# EAGLE design driver-board (EAGLE 9.3.0)

## Sheet 1 of 2
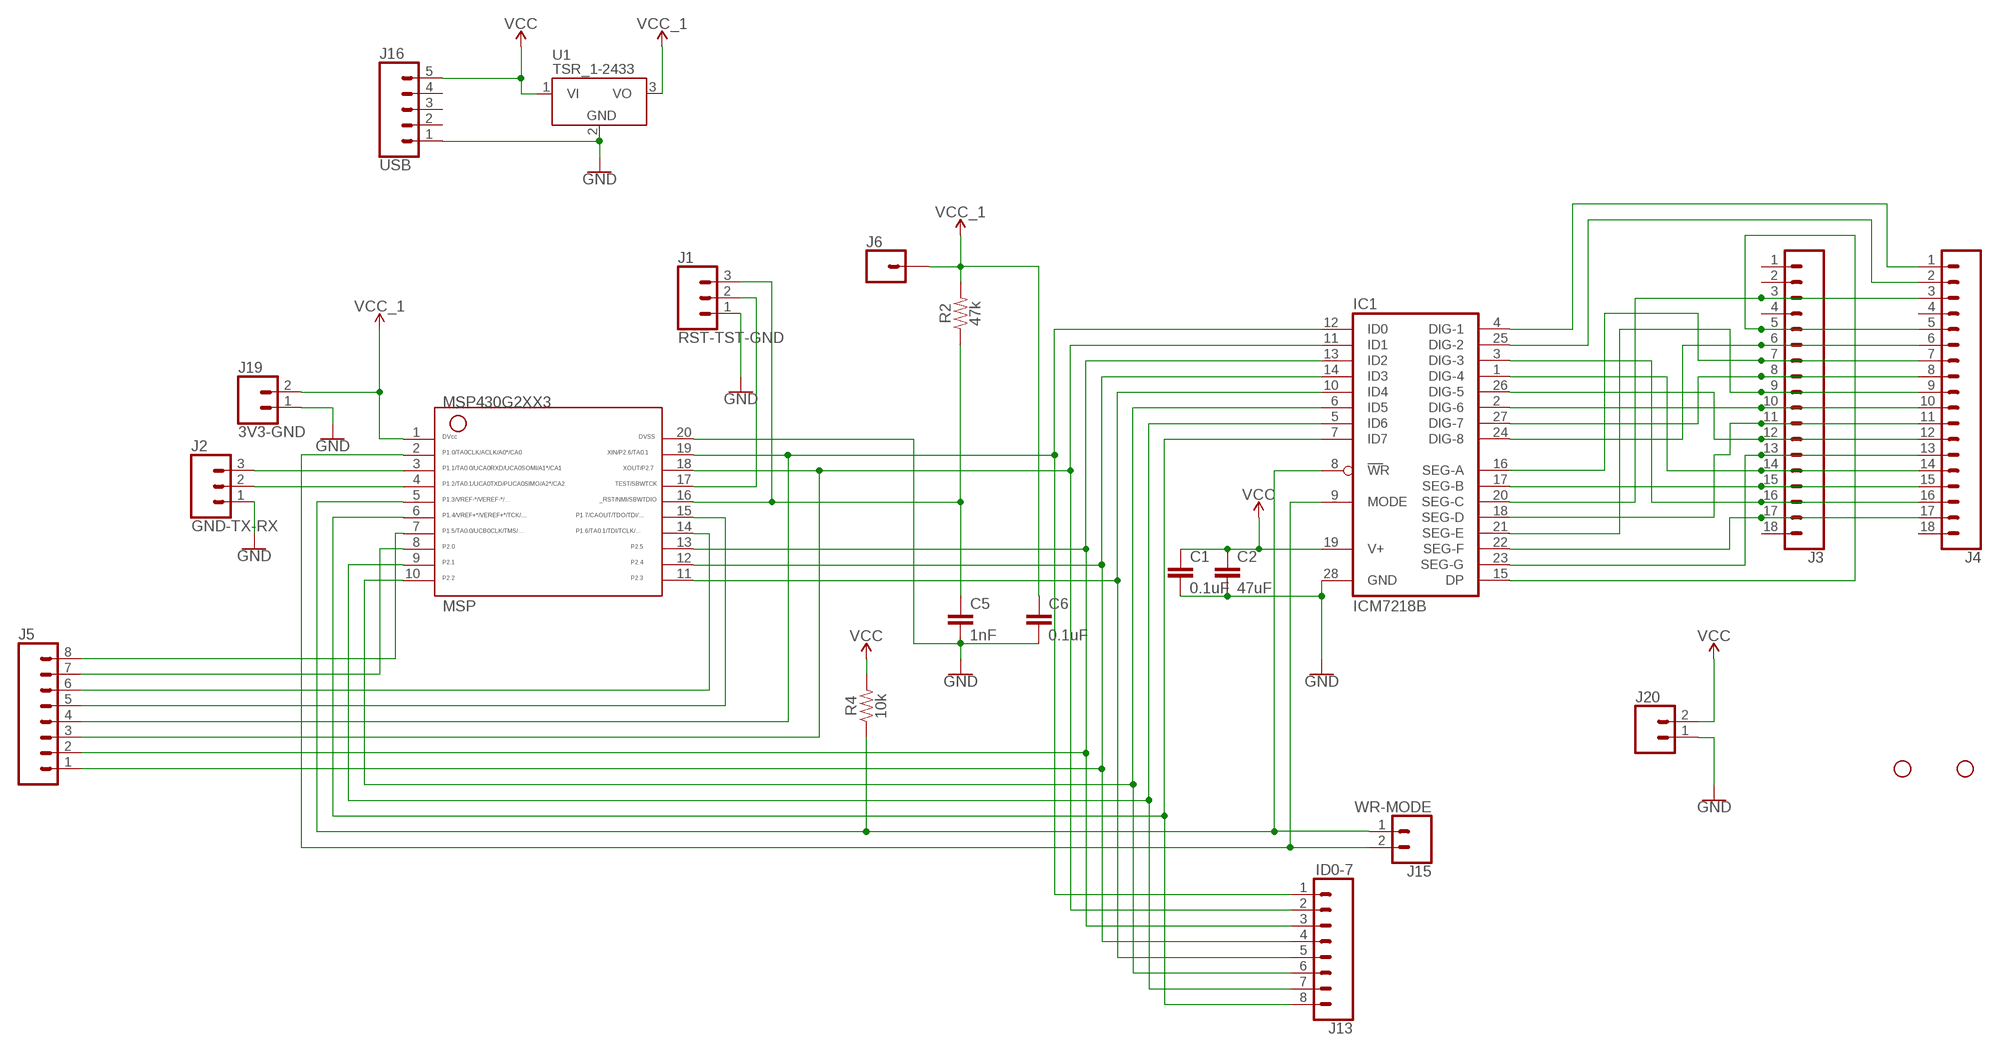
[diagram p0: schematic, sheet 1]

### Parts
C1  0.1uF  C2.5/2  [C2.5-2]
C2  47uF  C2.5/5  [C2.5-5]
C5  1nF  C5/2.5  [C5B2.5]
C6  0.1uF  C5/2.5  [C5B2.5]
H1  STAND-OFF  [STAND-OFF]
H2  STAND-OFF  [STAND-OFF]
IC1  ICM7218B  [DIL28-6]
J1  RST-TST-GND  CONN_03LOCK  [1X03_LOCK]
J2  GND-TX-RX  CONN_03LOCK  [1X03_LOCK]
J3  CONN_18  [1X18]
J4  CONN_18  [1X18]
J5  CONN_08"  [1X08]
J6  CONN_01  [1X01]
J13  ID0-7  CONN_08LOCK  [1X08_LOCK]
J15  WR-MODE  CONN_02  [1X02]
J16  USB  CONN_05LOCK  [1X05_LOCK]
J19  3V3-GND  CONN_02  [1X02]
J20  CONN_02  [1X02]
MSP  G2XX3---N20  [N20]
R2  47k  1KOHM-HORIZ-1/4W-1%  [AXIAL-0.3]
R4  10k  10KOHM-HORIZ-1/4W-1%  [AXIAL-0.3]
U1  TSR_1-2433  [TSR-1]

### Nets
GND: C1.2 C2.2 C5.2 C6.2 IC1.28(GND) J1.1 J2.1 J16.1 J19.1 J20.1 MSP.20 U1.2(GND)
N$1: IC1.3(DIG-3) J3.16 J4.16
N$2: IC1.1(DIG-4) J3.14 J4.14
N$3: IC1.26(DIG-5) J3.12 J4.12
N$4: J5.8 MSP.7
N$5: IC1.2(DIG-6) J3.10 J4.10
N$6: IC1.27(DIG-7) J3.8 J4.8
N$7: IC1.15(DP) J3.5 J4.5
N$8: IC1.23(SEG-G) J3.13 J4.13
N$9: IC1.24(DIG-8) J3.6 J4.6
N$10: IC1.22(SEG-F) J3.17 J4.17
N$11: IC1.20(SEG-C) J3.3 J4.3
N$12: J5.7 MSP.8
N$13: IC1.17(SEG-B) J3.15 J4.15
N$14: IC1.18(SEG-D) J3.11 J4.11
N$15: IC1.21(SEG-E) J3.9 J4.9
N$16: IC1.16(SEG-A) J3.7 J4.7
N$17: IC1.25(DIG-2) J4.2
N$18: IC1.4(DIG-1) J4.1
N$19: J2.2 MSP.4
N$20: J5.6 MSP.14
N$21: C5.1 J1.3 MSP.16 R2.P$1
N$22: J5.5 MSP.15
N$26: J1.2 MSP.17
N$27: IC1.14(ID3) J5.1 J13.4 MSP.12
N$28: IC1.10(ID4) J13.5 MSP.11
N$29: IC1.12(ID0) J5.4 J13.1 MSP.19
N$30: IC1.11(ID1) J5.3 J13.2 MSP.18
N$31: IC1.6(ID5) J13.6 MSP.10
N$32: IC1.5(ID6) J13.7 MSP.9
N$33: IC1.7(ID7) J13.8 MSP.6
N$34: IC1.8(WR) J15.1 MSP.5 R4.P$1
N$35: IC1.9(MODE) J15.2 MSP.2
N$36: J2.3 MSP.3
N$40: IC1.13(ID2) J5.2 J13.3 MSP.13
VCC: C1.1 C2.1 IC1.19(V+) J16.5 J20.2 R4.P$2 U1.1(VI)
VCC_1: C6.1 J6.1 J19.2 MSP.1 R2.P$2 U1.3(VO)
Unconnected: J3.1 J3.2 J3.4 J3.18 J4.4 J4.18 J16.2 J16.3 J16.4

## Sheet 2 of 2

## Library data of the parts
C1 C2 C5 C6 = capacitor-wima:C: CAPACITOR naming: grid - package width
H1 H2 = SparkFun-Hardware:STAND-OFF: Stand Off Drill holes for mechanically mounting via screws, standoffs, etc. Note: Use the keepout ring to avoid running the screw head into surrounding components. Variant Overviews STAND-OFF - Mechanical footprint for a #4 phillips button head screw. STAND-OFF-TIGHT - Mechanical footprint for a #4 phillips button head screw, Example SparkFun Products Screw - Phillips Head (1/4", 4-40, 10 pack) <https://www.sparkfun.com/products/10453> (PRT-10453) Screw - Phillips Head (1/2", 4-40, 10 pack) <https://www.sparkfun.com/products/10452> (PRT-10452) Screw - Phillips Head (3/4", 4-40, 10 pack) <https://www.sparkfun.com/products/10451> (PRT-10451) Screw - Phillips Head (1", 4-40, 10 pack) <https://www.sparkfun.com/products/10450> (PRT-10450)
IC1 = maxim:ICM7218B: LED DECODER DRIVER; MF: INTERSIL; MPN: ICM7218BIJI; OC_FARNELL: 406004; OC_NEWARK: 06F7545
J1 J2 = SparkFun-Connectors:CONN_03: Multi connection point. Often used as Generic Header-pin footprint for 0.1 inch spaced/style header connections On any of the 0.1 inch spaced packages, you can populate with these: Break Away Headers - Straight <https://www.sparkfun.com/products/116> (PRT-00116) Break Away Male Headers - Right Angle <https://www.sparkfun.com/products/553> (PRT-00553) Female Headers <https://www.sparkfun.com/products/115> (PRT-00115) Break Away Headers - Machine Pin <https://www.sparkfun.com/products/117> (PRT-00117) Break Away Female Headers - Swiss Machine Pin <https://www.sparkfun.com/products/743> (PRT-00743) Stackable Header - 3 Pin (Female, 0.1") <https://www.sparkfun.com/products/13875> (PRT-13875) For SCREWTERMINALS and SPRING TERMINALS visit here: Screw Terimnals on SparkFun.com <https://www.sparkfun.com/search/results?term=Screw+Terminals> (5mm/3.5mm/2.54mm spacing) This device is also useful as a general connection point to wire up your design to another part of your project. Our various solder wires solder well into these plated through hole pads. Hook-Up Wire - Assortment (Stranded, 22 AWG) <https://www.sparkfun.com/products/11375> (PRT-11375) Hook-Up Wire - Assortment (Solid Core, 22 AWG) <https://www.sparkfun.com/products/11367> (PRT-11367) View the entire wire category on our website here <https://www.sparkfun.com/categories/141> Special notes: Molex polarized connector foot print use with SKU : PRT-08232 with associated crimp pins and housings.
J3 J4 = SparkFun-Connectors:CONN_18: Multi connection point. Often used as Generic Header-pin footprint for 0.1 inch spaced/style header connections On any of the 0.1 inch spaced packages, you can populate with these: Break Away Headers - Straight <https://www.sparkfun.com/products/116> (PRT-00116) Break Away Male Headers - Right Angle <https://www.sparkfun.com/products/553> (PRT-00553) Female Headers <https://www.sparkfun.com/products/115> (PRT-00115) Break Away Headers - Machine Pin <https://www.sparkfun.com/products/117> (PRT-00117) Break Away Female Headers - Swiss Machine Pin <https://www.sparkfun.com/products/743> (PRT-00743) For SCREWTERMINALS and SPRING TERMINALS visit here: Screw Terimnals on SparkFun.com <https://www.sparkfun.com/search/results?term=Screw+Terminals> (5mm/3.5mm/2.54mm spacing) This device is also useful as a general connection point to wire up your design to another part of your project. Our various solder wires solder well into these plated through hole pads. Hook-Up Wire - Assortment (Stranded, 22 AWG) <https://www.sparkfun.com/products/11375> (PRT-11375) Hook-Up Wire - Assortment (Solid Core, 22 AWG) <https://www.sparkfun.com/products/11367> (PRT-11367) View the entire wire category on our website here <https://www.sparkfun.com/categories/141> Special notes: Molex polarized connector foot print use with SKU : PRT-08231 with associated crimp pins and housings. 1MM SMD Version SKU: PRT-10208 NOTES ON THE VARIANTS LOCK and LOCK_LONGPADS... This footprint was designed to help hold the alignment of a through-hole component (i.e. 6-pin header) while soldering it into place. You may notice that each hole has been shifted either up or down by 0.005 of an inch from it's more standard position (which is a perfectly straight line). This slight alteration caused the pins (the squares in the middle) to touch the edges of the holes. Because they are alternating, it causes a "brace" to hold the component in place. 0.005 has proven to be the perfect amount of "off-center" position when using our standard breakaway headers. Although looks a little odd when you look at the bare footprint, once you have a header in there, the alteration is very hard to notice. Also,if you push a header all the way into place, it is covered up entirely on the bottom side.
J5 = SparkFun-Connectors:CONN_08: Multi connection point. Often used as Generic Header-pin footprint for 0.1 inch spaced/style header connections On any of the 0.1 inch spaced packages, you can populate with these: Break Away Headers - Straight <https://www.sparkfun.com/products/116> (PRT-00116) Break Away Male Headers - Right Angle <https://www.sparkfun.com/products/553> (PRT-00553) Female Headers <https://www.sparkfun.com/products/115> (PRT-00115) Break Away Headers - Machine Pin <https://www.sparkfun.com/products/117> (PRT-00117) Break Away Female Headers - Swiss Machine Pin <https://www.sparkfun.com/products/743> (PRT-00743) Arduino Stackable Header - 8 Pin <https://www.sparkfun.com/products/9279> (PRT-09279) For SCREWTERMINALS and SPRING TERMINALS visit here: Screw Terimnals on SparkFun.com <https://www.sparkfun.com/search/results?term=Screw+Terminals> (5mm/3.5mm/2.54mm spacing) This device is also useful as a general connection point to wire up your design to another part of your project. Our various solder wires solder well into these plated through hole pads. Hook-Up Wire - Assortment (Stranded, 22 AWG) <https://www.sparkfun.com/products/11375> (PRT-11375) Hook-Up Wire - Assortment (Solid Core, 22 AWG) <https://www.sparkfun.com/products/11367> (PRT-11367) View the entire wire category on our website here <https://www.sparkfun.com/categories/141> Special notes: Molex polarized connector foot print use with SKU : PRT-08231 with associated crimp pins and housings. 1MM SMD Version SKU: PRT-10208 NOTES ON THE VARIANTS LOCK and LOCK_LONGPADS... This footprint was designed to help hold the alignment of a through-hole component (i.e. 6-pin header) while soldering it into place. You may notice that each hole has been shifted either up or down by 0.005 of an inch from it's more standard position (which is a perfectly straight line). This slight alteration caused the pins (the squares in the middle) to touch the edges of the holes. Because they are alternating, it causes a "brace" to hold the component in place. 0.005 has proven to be the perfect amount of "off-center" position when using our standard breakaway headers. Although looks a little odd when you look at the bare footprint, once you have a header in there, the alteration is very hard to notice. Also,if you push a header all the way into place, it is covered up entirely on the bottom side.; PROD_ID: CONN-08438
J6 = SparkFun-Connectors:CONN_01: Single connection point. Often used as Generic Header-pin footprint for 0.1 inch spaced/style header connections On any of the 0.1 inch spaced packages, you can populate with these: Break Away Headers - Straight <https://www.sparkfun.com/products/116> (PRT-00116) Break Away Male Headers - Right Angle <https://www.sparkfun.com/products/553> (PRT-00553) Female Headers <https://www.sparkfun.com/products/115> (PRT-00115) Break Away Headers - Machine Pin <https://www.sparkfun.com/products/117> (PRT-00117) Break Away Female Headers - Swiss Machine Pin <https://www.sparkfun.com/products/743> (PRT-00743) This device is also useful as a general connection point to wire up your design to another part of your project. Our various solder wires solder well into these plated through hole pads. Hook-Up Wire - Assortment (Stranded, 22 AWG) <https://www.sparkfun.com/products/11375> (PRT-11375) Hook-Up Wire - Assortment (Solid Core, 22 AWG) <https://www.sparkfun.com/products/11367> (PRT-11367) View the entire wire category on our website here <https://www.sparkfun.com/categories/141> Special notes: SMTSO-256-ET is a "flush mount" nut for a 4-40 screw. We mostly use this on specialty testbeds; it is a nice way to connect hardware to your PCB at an adjustable hieght. Also note, the SNAP packages are for using a snappable style connector. We sell a baggie of snaps and they are also used on two LilyPad designs: Snap Assortment - 30 pack (male and female) <https://www.sparkfun.com/products/11347> (DEV-11347) LilyPad Arduino SimpleSnap <https://www.sparkfun.com/products/10941> (DEV-10941) LilyPad SimpleSnap Protoboard <https://www.sparkfun.com/products/10940> (DEV-10940)
J13 = SparkFun-Connectors:CONN_08: Multi connection point. Often used as Generic Header-pin footprint for 0.1 inch spaced/style header connections On any of the 0.1 inch spaced packages, you can populate with these: Break Away Headers - Straight <https://www.sparkfun.com/products/116> (PRT-00116) Break Away Male Headers - Right Angle <https://www.sparkfun.com/products/553> (PRT-00553) Female Headers <https://www.sparkfun.com/products/115> (PRT-00115) Break Away Headers - Machine Pin <https://www.sparkfun.com/products/117> (PRT-00117) Break Away Female Headers - Swiss Machine Pin <https://www.sparkfun.com/products/743> (PRT-00743) Arduino Stackable Header - 8 Pin <https://www.sparkfun.com/products/9279> (PRT-09279) For SCREWTERMINALS and SPRING TERMINALS visit here: Screw Terimnals on SparkFun.com <https://www.sparkfun.com/search/results?term=Screw+Terminals> (5mm/3.5mm/2.54mm spacing) This device is also useful as a general connection point to wire up your design to another part of your project. Our various solder wires solder well into these plated through hole pads. Hook-Up Wire - Assortment (Stranded, 22 AWG) <https://www.sparkfun.com/products/11375> (PRT-11375) Hook-Up Wire - Assortment (Solid Core, 22 AWG) <https://www.sparkfun.com/products/11367> (PRT-11367) View the entire wire category on our website here <https://www.sparkfun.com/categories/141> Special notes: Molex polarized connector foot print use with SKU : PRT-08231 with associated crimp pins and housings. 1MM SMD Version SKU: PRT-10208 NOTES ON THE VARIANTS LOCK and LOCK_LONGPADS... This footprint was designed to help hold the alignment of a through-hole component (i.e. 6-pin header) while soldering it into place. You may notice that each hole has been shifted either up or down by 0.005 of an inch from it's more standard position (which is a perfectly straight line). This slight alteration caused the pins (the squares in the middle) to touch the edges of the holes. Because they are alternating, it causes a "brace" to hold the component in place. 0.005 has proven to be the perfect amount of "off-center" position when using our standard breakaway headers. Although looks a little odd when you look at the bare footprint, once you have a header in there, the alteration is very hard to notice. Also,if you push a header all the way into place, it is covered up entirely on the bottom side.
J15 J19 J20 = SparkFun-Connectors:CONN_02: Multi connection point. Often used as Generic Header-pin footprint for 0.1 inch spaced/style header connections On any of the 0.1 inch spaced packages, you can populate with these: Break Away Headers - Straight <https://www.sparkfun.com/products/116> (PRT-00116) Break Away Male Headers - Right Angle <https://www.sparkfun.com/products/553> (PRT-00553) Female Headers <https://www.sparkfun.com/products/115> (PRT-00115) Break Away Headers - Machine Pin <https://www.sparkfun.com/products/117> (PRT-00117) Break Away Female Headers - Swiss Machine Pin <https://www.sparkfun.com/products/743> (PRT-00743) For SCREWTERMINALS and SPRING TERMINALS visit here: Screw Terimnals on SparkFun.com <https://www.sparkfun.com/search/results?term=Screw+Terminals> (5mm/3.5mm/2.54mm spacing) This device is also useful as a general connection point to wire up your design to another part of your project. Our various solder wires solder well into these plated through hole pads. Hook-Up Wire - Assortment (Stranded, 22 AWG) <https://www.sparkfun.com/products/11375> (PRT-11375) Hook-Up Wire - Assortment (Solid Core, 22 AWG) <https://www.sparkfun.com/products/11367> (PRT-11367) View the entire wire category on our website here <https://www.sparkfun.com/categories/141> Special notes: Molex polarized connector foot print use with: PRT-08233 with associated crimp pins and housings. 2.54_SCREWTERM for use with PRT-10571. 3.5mm Screw Terminal footprints for PRT-08084 5mm Screw Terminal footprints for use with PRT-08432
J16 = SparkFun-Connectors:CONN_05: Multi connection point. Often used as Generic Header-pin footprint for 0.1 inch spaced/style header connections On any of the 0.1 inch spaced packages, you can populate with these: Break Away Headers - Straight <https://www.sparkfun.com/products/116> (PRT-00116) Break Away Male Headers - Right Angle <https://www.sparkfun.com/products/553> (PRT-00553) Female Headers <https://www.sparkfun.com/products/115> (PRT-00115) Break Away Headers - Machine Pin <https://www.sparkfun.com/products/117> (PRT-00117) Break Away Female Headers - Swiss Machine Pin <https://www.sparkfun.com/products/743> (PRT-00743) For SCREWTERMINALS and SPRING TERMINALS visit here: Screw Terimnals on SparkFun.com <https://www.sparkfun.com/search/results?term=Screw+Terminals> (5mm/3.5mm/2.54mm spacing) This device is also useful as a general connection point to wire up your design to another part of your project. Our various solder wires solder well into these plated through hole pads. Hook-Up Wire - Assortment (Stranded, 22 AWG) <https://www.sparkfun.com/products/11375> (PRT-11375) Hook-Up Wire - Assortment (Solid Core, 22 AWG) <https://www.sparkfun.com/products/11367> (PRT-11367) View the entire wire category on our website here <https://www.sparkfun.com/categories/141> Special notes: Molex polarized connector foot print use with SKU : PRT-08231 with associated crimp pins and housings. 1MM SMD Version SKU: PRT-10208
MSP = 1 - Jim:G2XX3---N20: MSP430G2XX3 PDIP (N) 20 Pin Package
R2 = SparkFun-Resistors:1KOHM: 1kΩ resistor A resistor is a passive two-terminal electrical component that implements electrical resistance as a circuit element. Resistors act to reduce current flow, and, at the same time, act to lower voltage levels within circuits. - Wikipedia; PROD_ID: RES-12182; VALUE: 1k
R4 = SparkFun-Resistors:10KOHM: 10kΩ resistor A resistor is a passive two-terminal electrical component that implements electrical resistance as a circuit element. Resistors act to reduce current flow, and, at the same time, act to lower voltage levels within circuits. - Wikipedia; PROD_ID: RES-12183
U1 = _traco_tsr-1:TSR_1-*: TRACO TSR-1 Series Point-of-Load DC/DC-Converters Vi max. 36 V; Vo = (1.2 .. 15)V ±2%; Io = 0 .. 1 A SIP-Package (drop-in replacement for 78xx linear voltage regulators in TO220-package, vertically assembled) Source: www.tracopower.com Technologies: TSR 1- Vi (V) Vo (V) ±2% Io = 0 .. 1 A 24_ ( generic ) 2412 4.6 .. 36 1.2 2415 4.6 .. 36 1.5 2418 4.6 .. 36 1.8 2425 4.6 .. 36 2.5 2433 4.75.. 36 3.3 2450 6.5 .. 36 5.0 2465 9.0 .. 36 6.5 2490 12 .. 36 9.0 24120 15 .. 36 12 24150 18 .. 36 15 Author: Dipl.-Ing. FH Rainer Bayer HHN Hochschule Heilbronn, rainer.bayer@hs-heilbronn.de Ingenieurbüro ing-rb, mail@ing-rb.de

## Board
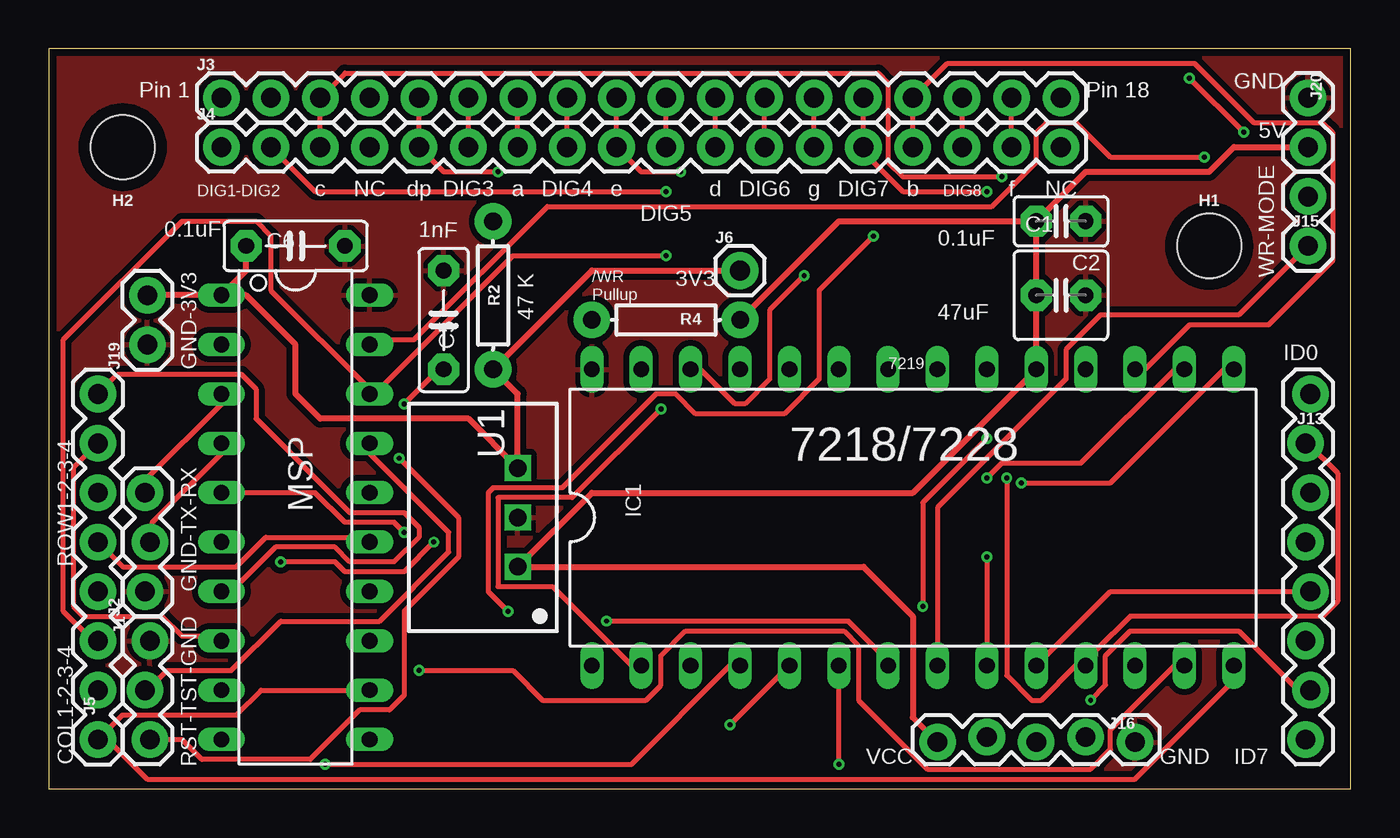
[diagram p1: board, top side]
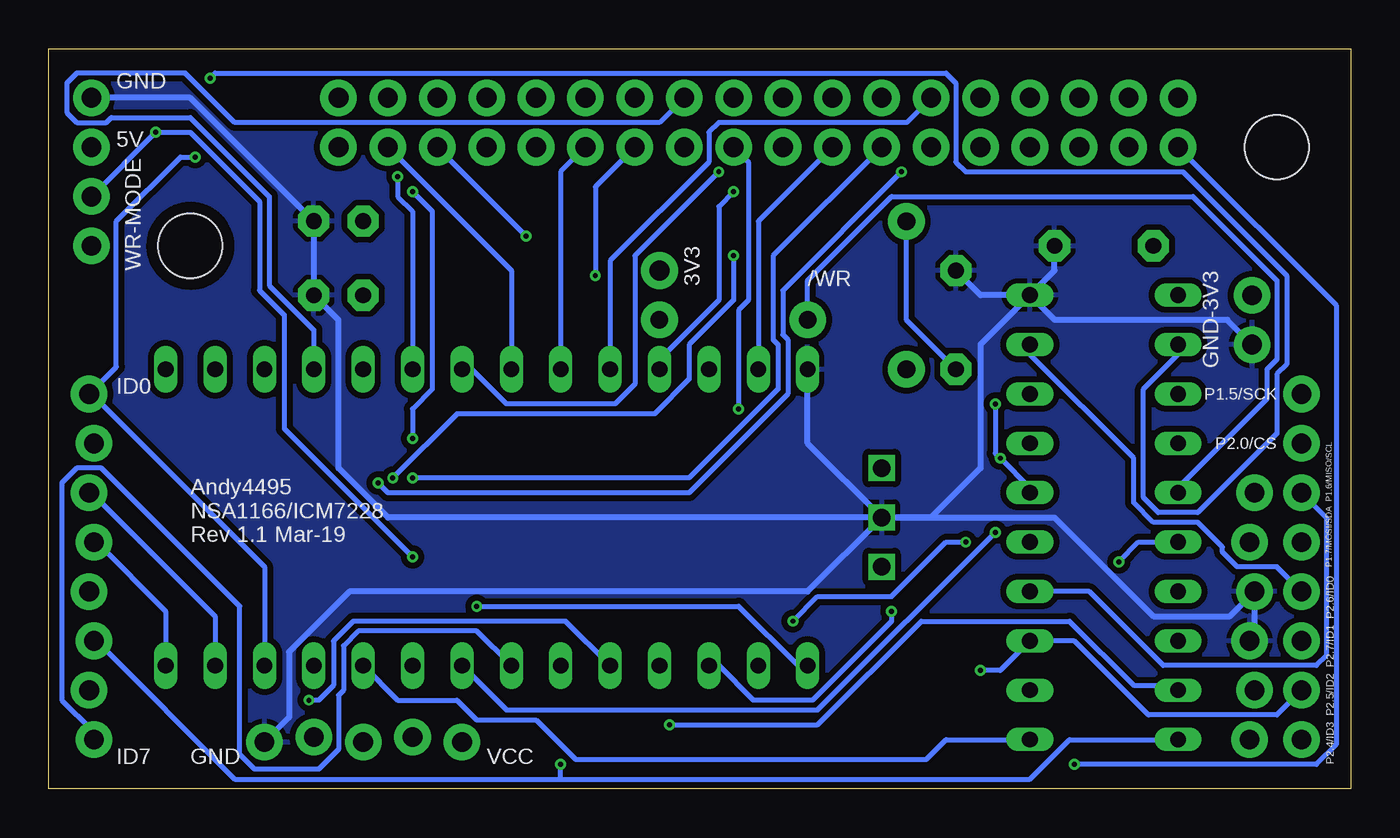
[diagram p2: board, bottom side, seen from below]

Size 66.98 x 38.09 mm. Coordinates in mm from the lower left corner, seen from the top.
Outline: 0,0 66.98,0 66.98,38.09 0,38.09 0,0
Copper layers (1*16): Top 0.035559375mm / dielectric 1.6mm / Bottom 0.035559375mm
Design rules "oshpark-2layer-auto-routing": minimum track width 10mil, minimum drill 10mil, track to track 10mil, track to pad 8mil, pad to pad 8mil, via to via 8mil, smd to smd 6mil, copper to edge 15mil, drill to drill 6mil, minimum pad ring 6mil, minimum via ring 6mil, stop-mask expansion 2.5mil, vias tented up to drill 0mil, thermal gap 10mil

### Footprints (pad centres in the part's own frame; a part is rotated, then mirrored left to right if it is on the bottom)
C2.5-2 = drill 0.813 pad 1.6 octagon: 1 -1.27,0; 2 1.27,0
C2.5-5 = drill 0.813 pad 1.6 octagon: 1 -1.27,0; 2 1.27,0
C5B2.5 = drill 0.813 pad 1.6 octagon: 1 -2.54,0; 2 2.54,0
STAND-OFF = hole 3.302: 0,0
DIL28-6 = drill 0.813 long: 1 -16.51,-7.62; 2 -13.97,-7.62; 3 -11.43,-7.62; 4 -8.89,-7.62; 5 -6.35,-7.62; 6 -3.81,-7.62; 7 -1.27,-7.62; 8 1.27,-7.62; 9 3.81,-7.62; 10 6.35,-7.62; 11 8.89,-7.62; 12 11.43,-7.62; 13 13.97,-7.62; 14 16.51,-7.62; 15 16.51,7.62; 16 13.97,7.62; 17 11.43,7.62; 18 8.89,7.62; 19 6.35,7.62; 20 3.81,7.62; 21 1.27,7.62; 22 -1.27,7.62; 23 -3.81,7.62; 24 -6.35,7.62; 25 -8.89,7.62; 26 -11.43,7.62; 27 -13.97,7.62; 28 -16.51,7.62
1X03_LOCK = drill 1.016 pad 1.88: 1 0,0.127; 2 2.54,-0.127; 3 5.08,0.127
1X18 = drill 1.016 pad 1.88: 1 0,0; 2 2.54,0; 3 5.08,0; 4 7.62,0; 5 10.16,0; 6 12.7,0; 7 15.24,0; 8 17.78,0; 9 20.32,0; 10 22.86,0; 11 25.4,0; 12 27.94,0; 13 30.48,0; 14 33.02,0; 15 35.56,0; 16 38.1,0; 17 40.64,0; 18 43.18,0
1X08 = drill 1.016 pad 1.88: 1 0,0; 2 2.54,0; 3 5.08,0; 4 7.62,0; 5 10.16,0; 6 12.7,0; 7 15.24,0; 8 17.78,0
1X01 = drill 1.016 pad 1.88: 1 0,0
1X08_LOCK = drill 1.016 pad 1.88: 1 0,0.127; 2 2.54,-0.127; 3 5.08,0.127; 4 7.62,-0.127; 5 10.16,0.127; 6 12.7,-0.127; 7 15.24,0.127; 8 17.78,-0.127
1X02 = drill 1.016 pad 1.88: 1 0,0; 2 2.54,0
1X05_LOCK = drill 1.016 pad 1.88: 1 0,0.127; 2 2.54,-0.127; 3 5.08,0.127; 4 7.62,-0.127; 5 10.16,0.127
N20 = drill 0.813 long: 1 -11.435,-3.81; 2 -8.895,-3.81; 3 -6.355,-3.81; 4 -3.815,-3.81; 5 -1.275,-3.81; 6 1.265,-3.81; 7 3.805,-3.81; 8 6.345,-3.81; 9 8.885,-3.81; 10 11.425,-3.81; 11 11.425,3.81; 12 8.885,3.81; 13 6.345,3.81; 14 3.805,3.81; 15 1.265,3.81; 16 -1.275,3.81; 17 -3.815,3.81; 18 -6.355,3.81; 19 -8.895,3.81; 20 -11.435,3.81
AXIAL-0.3 = drill 0.9 pad 1.88: P$1 -3.81,0; P$2 3.81,0
TSR-1 = drill 0.9 square: 1 -2.54,0; 2 0,0; 3 2.54,0

### Placement (x,y rotation side)
C1  52.07,29.21 0 top
C2  52.07,25.4 0 top
C5  20.32,24.13 90 top
C6  12.7,27.94 0 top
H1  59.69,27.94 0 top
H2  3.81,33.02 0 top
IC1  44.45,13.97 0 top
J1  5.08,7.62 270 top
J2  5.08,10.16 90 top
J3  8.89,35.56 0 top
J4  8.89,33.02 0 top
J5  2.54,2.54 90 top
J6  35.56,26.67 0 top
J13  64.77,20.32 270 top
J15  64.77,27.94 90 top
J16  55.88,2.54 180 top
J19  5.08,22.86 90 top
J20  64.77,35.56 270 top
MSP  12.7,13.97 270 top
R2  22.86,25.4 270 top
R4  31.75,24.13 0 top
U1  24.13,13.97 90 top

### Tracks (layer width: path | path; a pad name or v marks a point on that pad's centre or on a via)
GND
  Bottom 0.305: J1.1 4.95,7.87 J2.1 6.22,8.89 10.16,8.89 15.24,13.97 U1.2 | MSP.20 19.05,22.86 19.05,16.51 21.59,13.97 U1.2 | MSP.20 19.06,25.4 C5.2 | MSP.20 15.24,26.68 C6.2 | J19.1 6.35,24.13 15.23,24.13 MSP.20 | U1.2 27.94,17.78 IC1.28 | U1.2 27.94,10.16 51.5,10.16 54.61,7.06 54.61,3.68 J16.1 | U1.2 49.53,13.97 52.07,16.51 52.07,24.13 C2.2 C1.2 59.69,35.56 J20.1
  pour Top (isolate 0.305): 0,38.1 67.31,38.1 67.31,0 0,0
  pour Bottom (isolate 0.305): 0,38.1 67.31,38.1 67.31,0 0,0
N$1  (via drill 0.25)
  Top 0.254: J4.16 J3.16 | v23.62,9.14 22.61,10.16 22.61,15.24 22.86,15.49 26.42,15.49 31.24,20.32 32.26,20.32 33.27,19.3 37.85,19.3 39.62,21.08 39.62,25.65 v42.42,28.45
  Bottom 0.254: IC1.3 32.51,6.35 30.73,4.57 27.69,4.57 23.62,8.64 v23.62,9.14 | J4.16 v42.42,28.45
N$2  (via drill 0.25)
  Top 0.254: J3.14 J4.14 41.91,32.77 43.94,30.73 v48.26,30.73 | v44.96,9.4 44.96,14.73 v48.26,18.03
  Bottom 0.254: IC1.1 28.45,6.35 31.5,9.4 v44.96,9.4 | v48.26,18.03 48.26,19.56 47.24,20.57 47.24,29.72 v48.26,30.73
N$3  (via drill 0.25)
  Top 0.254: J4.12 J3.12 | IC1.26 33.53,21.59 35.31,19.81 35.81,19.81 37.08,21.08 37.08,24.64 v38.86,26.42
  Bottom 0.254: v38.86,26.42 38.86,30.99 J4.12
N$4
  Top 0.254: J5.8 3.56,21.34 9.91,21.34 10.67,20.57 10.67,19.05 15.49,14.22 18.29,14.22 19.05,13.46 19.05,12.95 17.78,11.68 15.49,11.68 14.73,12.45 11.68,12.45 9.65,10.41 8.89,10.41 MSP.7
N$5  (via drill 0.25)
  Top 0.254: J4.10 J3.10 | IC1.2 29.97,6.35 25.91,10.41 23.11,10.41 23.11,14.99 26.92,14.99 v31.5,19.56
  Bottom 0.254: v31.5,19.56 31.5,24.64 30.99,25.15 30.99,32.26 J4.10
N$6
  Top 0.254: J4.8 J3.8
  Bottom 0.254: IC1.27 30.48,29.21 J4.8
N$7  (via drill 0.25)
  Top 0.254: J3.5 J4.5 20.32,31.75 v23.11,31.75 | IC1.15 60.45,21.59 54.61,15.75 v50.04,15.75
  Bottom 0.254: v50.04,15.75 49.53,15.24 34.04,15.24 28.96,20.32 28.96,23.11 29.21,23.37 29.21,25.65 v23.11,31.75
N$8
  Top 0.254: J4.13 J3.13
  Bottom 0.254: IC1.23 40.64,31.75 J4.13
N$9
  Top 0.254: J4.6 J3.6
  Bottom 0.254: IC1.24 38.1,27.18 33.02,32.26 33.02,33.78 32.51,34.29 22.86,34.29 J3.6
N$10
  Top 0.254: J4.17 J3.17
  Bottom 0.254: IC1.22 43.18,26.67 J4.17
N$11  (via drill 0.25)
  Top 0.254: J4.3 J3.3 15.24,36.83 42.67,36.83 43.18,36.32 43.18,32.26 43.94,31.5 v49.02,31.5
  Bottom 0.254: IC1.20 48.26,29.72 49.02,30.48 v49.02,31.5
N$12
  Top 0.254: J5.7 1.27,16.51 1.27,9.4 1.78,8.89 5.84,8.89 6.86,7.87 8.89,7.87 MSP.8
N$13
  Top 0.254: J4.15 J3.15 46.23,37.34 58.93,37.34 61.98,34.29 65.53,34.29 66.04,33.78 66.04,27.18 62.74,23.88 58.67,23.88 56.39,21.59 IC1.17
N$14
  Top 0.254: J4.11 J3.11
  Bottom 0.254: IC1.18 53.34,23.62 55.63,25.91 55.63,30.48 59.69,34.54 63.75,34.54 64.01,34.29 65.53,34.29 66.04,34.8 66.04,36.32 65.53,36.83 59.94,36.83 57.4,34.29 35.56,34.29 J3.11
N$15  (via drill 0.25)
  Top 0.254: J3.9 J4.9 30.48,31.75 v32.51,31.75
  Bottom 0.254: IC1.21 45.21,21.59 43.43,19.81 37.85,19.81 36.83,20.83 36.83,27.43 v32.51,31.75
N$16  (via drill 0.25)
  Top 0.254: J4.7 J3.7 | IC1.16 57.91,21.59 53.09,16.76 49.02,16.76 v48.26,16
  Bottom 0.254: v48.26,16 34.04,16 29.46,20.57 29.46,22.86 29.72,23.11 29.72,27.43 J4.7
N$17  (via drill 0.25)
  Top 0.254: v31.75,30.73 13.72,30.73 J4.2
  Bottom 0.254: IC1.25 35.56,22.1 32.51,25.15 32.51,29.97 v31.75,30.73
N$18  (via drill 0.25)
  Top 0.254: IC1.4 35.05,6.35 29.97,1.27 v14.22,1.27
  Bottom 0.254: v14.22,1.27 1.78,1.27 0.76,2.29 0.76,24.89 J4.1
N$19
  Top 0.254: MSP.4 8.89,17.27 5.33,13.72 5.33,12.7 J2.2
N$20
  Bottom 0.254: J5.6 1.27,13.97 1.27,6.86 1.78,6.35 9.65,6.35 13.46,10.16 MSP.14
N$21  (via drill 0.25)
  Top 0.254: v18.29,19.81 20.07,21.59 C5.1 | J1.3 6.86,2.54 7.87,1.52 13.46,1.52 16,4.06 17.53,4.06 18.29,4.83 18.29,9.14 21.08,11.94 21.08,13.97 v18.03,17.02
  Bottom 0.254: v18.29,19.81 18.29,17.27 v18.03,17.02 16.51,15.49 MSP.16 | R2.P$1 22.86,24.13 C5.1
N$22
  Top 0.254: J5.5 3.81,11.43 9.65,11.43 11.18,12.95 16.51,12.95 MSP.15
N$26
  Top 0.254: MSP.17 16.51,17.27 20.57,13.21 20.57,12.19 17.02,8.64 11.94,8.64 9.4,6.1 6.1,6.1 5.08,5.08 J1.2
N$27
  Top 0.254: 2.79,2.79 3.81,3.81 9.65,3.81 10.92,5.08 MSP.12 | IC1.14 60.96,5.59 55.88,0.51 5.08,0.51 2.79,2.79 | 2.79,2.79 J5.1
  Bottom 0.254: IC1.14 60.96,9.14 64.52,12.7 J13.4
N$28
  Top 0.254: J13.5 54.61,10.16 IC1.10
  Bottom 0.254: IC1.10 49.02,4.57 45.97,4.57 44.96,3.56 41.91,3.56 39.88,1.52 21.84,1.52 20.83,2.54 MSP.11
N$29  (via drill 0.25)
  Top 0.254: v59.44,32.51 54.61,32.51 52.83,34.29 51.31,34.29 50.8,33.78 50.8,32.26 48.51,29.97 25.65,29.97 18.8,23.11 16.51,23.11 MSP.19
  Bottom 0.254: IC1.12 55.88,11.43 64.77,20.32 J13.1 63.5,21.72 63.5,29.21 60.2,32.51 v59.44,32.51 | MSP.19 16.51,22.35 11.18,17.02 11.18,14.73 10.16,13.72 7.87,13.72 6.6,12.45 6.6,12.19 5.84,11.43 3.81,11.43 J5.4
N$30  (via drill 0.25)
  Top 0.254: J13.2 64.77,17.78 66.29,16.26 66.29,9.65 65.53,8.89 55.63,8.89 53.85,7.11 53.85,6.86 IC1.11 52.83,6.35 51.05,4.57 50.55,4.57 49.28,5.84 v49.28,16 | 16.51,20.57 11.43,25.65 11.43,28.45 10.67,29.21 6.86,29.21 0.76,23.11 0.76,9.14 2.29,7.62 J5.3 | v31.75,27.43 23.88,27.43 17.02,20.57 16.51,20.57 | 16.51,20.57 MSP.18
  Bottom 0.254: v49.28,16 45.97,19.3 35.81,19.3 34.04,21.08 34.04,22.86 31.75,25.15 v31.75,27.43
N$31  (via drill 0.25)
  Top 0.254: v40.64,1.27 IC1.6
  Bottom 0.254: 40.64,0.51 57.4,0.51 64.52,7.62 J13.6 | 40.64,0.51 16.51,0.51 14.48,2.54 MSP.10 | 40.64,0.51 v40.64,1.27
N$32  (via drill 0.25)
  Top 0.254: IC1.5 v35.05,3.3 | J13.7 64.26,5.08 61.21,8.13 55.63,8.13 54.36,6.86 54.36,5.33 v53.59,4.57
  Bottom 0.254: v35.05,3.3 27.43,3.3 22.1,8.64 14.48,8.64 11.18,5.33 8.89,5.33 MSP.9 | v53.59,4.57 53.09,4.57 52.32,5.33 52.32,7.62 51.31,8.64 40.39,8.64 IC1.5
N$33  (via drill 0.25)
  Top 0.254: v11.94,11.68 14.73,11.68 15.24,11.18 18.29,11.18 v19.81,12.7 | v28.7,8.64 41.15,8.64 43.18,6.6 IC1.7
  Bottom 0.254: v11.94,11.68 10.92,12.7 MSP.6 | v19.81,12.7 20.83,12.7 23.62,9.91 27.43,9.91 v28.7,8.64 | IC1.7 44.96,8.13 51.05,8.13 51.82,7.37 51.82,5.08 52.07,4.83 52.07,2.03 53.09,1.02 56.39,1.02 57.15,1.78 57.15,9.4 64.26,16.51 65.53,16.51 66.29,15.75 66.29,4.57 64.77,3.05 64.77,2.54 J13.8
N$34  (via drill 0.25)
  Top 0.254: IC1.8 45.72,14.48 52.32,21.08 52.32,22.61 54.1,24.38 61.21,24.38 J15.1 | v18.29,13.21 17.78,13.72 15.24,13.72 13.72,15.24 MSP.5
  Bottom 0.254: R4.P$1 27.94,26.16 23.62,30.48 8.13,30.48 3.81,26.16 3.81,22.1 4.32,21.59 4.32,20.07 8.89,15.49 MSP.5 | v18.29,13.21 27.43,4.06 43.43,4.06 IC1.8
N$35  (via drill 0.25)
  Top 0.254: v61.47,33.78 v58.67,36.58 | v48.26,11.94 IC1.9
  Bottom 0.254: MSP.2 8.89,22.35 10.67,20.57 10.67,14.99 9.91,14.22 7.87,14.22 3.81,18.29 3.81,21.34 3.3,21.84 3.3,26.42 8.64,31.75 19.81,31.75 20.32,32.26 20.32,36.32 20.83,36.83 58.42,36.83 v58.67,36.58 | J15.2 v61.47,33.78 59.69,33.78 56.13,30.23 56.13,25.65 54.86,24.38 54.86,18.54 v48.26,11.94
N$36
  Top 0.254: MSP.3 8.89,19.81 5.08,16 5.08,15.24 J2.3
N$40  (via drill 0.25)
  Top 0.254: IC1.13 57.91,6.35 54.61,3.05 54.61,2.03 53.59,1.02 45.21,1.02 41.66,4.57 41.66,7.37 40.89,8.13 32.77,8.13 31.5,6.86 31.5,5.33 30.73,4.57 25.4,4.57 23.88,6.1 v19.05,6.1
  Bottom 0.254: IC1.13 58.42,8.89 64.77,15.24 J13.3 | MSP.13 14.22,7.62 10.41,3.81 3.81,3.81 J5.2 | v19.05,6.1 18.03,6.1 MSP.13 | MSP.13
VCC
  Top 0.305: J16.5 44.45,3.68 44.45,8.89 41.91,11.43 U1.1 27.94,15.24 44.45,15.24 IC1.19 C2.1 C1.1 | J20.2 60.96,33.02 59.69,31.75 53.34,31.75 C1.1 | R4.P$2 40.64,29.21 C1.1
VCC_1
  Top 0.305: MSP.1 J19.2 | MSP.1 10.16,26.68 C6.1 | MSP.1 10.16,25.4 12.7,22.86 12.7,20.32 13.97,19.05 21.59,19.05 U1.3 24.13,20.32 R2.P$2 27.94,26.67 J6.1

### Text on the board
tPlace: GND | Pin 1 | Pin 18 | 5V | DIG1-DIG2 | c | NC | dp | DIG3 | a | DIG4 | e | d | DIG6 | g | DIG7 | b | DIG8 | f | NC | 0.1uF | 1nF | DIG5 | WR-MODE | 0.1uF | /WR / Pullup | 3V3 | 47 K | 47uF | ID0 | GND-3V3 | 7219 | 7218/7228 | ROW1-2-3-4 | GND-TX-RX | RST-TST-GND | COL1-2-3-4 | VCC | GND | ID7
bPlace: GND | 5V | 3V3 | GND-3V3 | /WR | WR-MODE | P1.5/SCK | ID0 | P2.0/CS | Andy4495 / NSA1166/ICM7228 / Rev 1.1 Mar-19 | P1.7/MOSI/SDA P1.6/MISO/SCL | P2.4/ID3 P2.5/ID2 P2.7/ID1 P2.6/ID0 | VCC | GND | ID7